# Altium schematic sheet czujniki.SchDoc
size A0; SheetNumber: 1; SheetTotal: 7
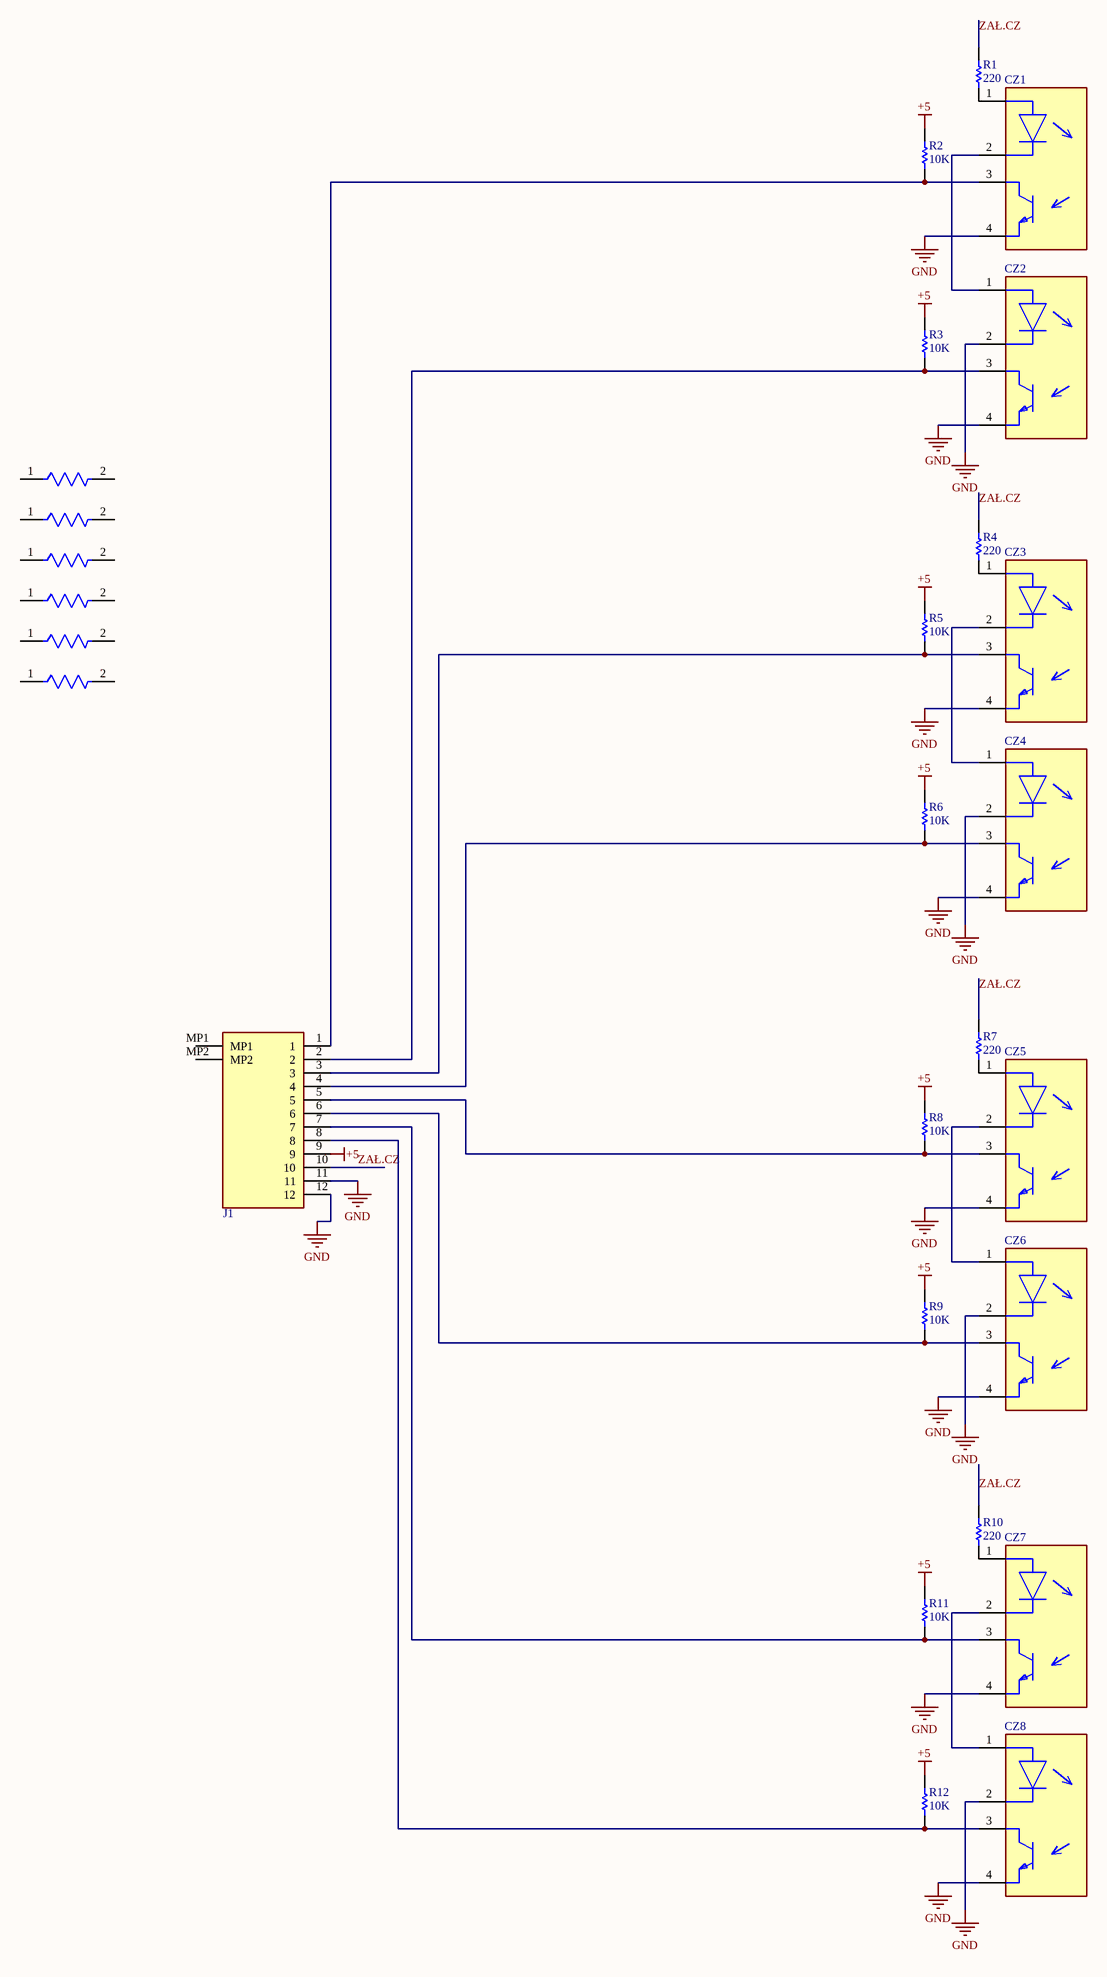
[diagram p0: czujniki.SchDoc]

## Parts
(Parts that share a designator on the sheet are numbered #1, #2 ... from top to bottom, then left to right.)
CZ1  QRE1113GR  [FP-100CY-MFG]  (value not drawn)
CZ2  QRE1113GR  [FP-100CY-MFG]  (value not drawn)
CZ3  QRE1113GR  [FP-100CY-MFG]  (value not drawn)
CZ4  QRE1113GR  [FP-100CY-MFG]  (value not drawn)
CZ5  QRE1113GR  [FP-100CY-MFG]  (value not drawn)
CZ6  QRE1113GR  [FP-100CY-MFG]  (value not drawn)
CZ7  QRE1113GR  [FP-100CY-MFG]  (value not drawn)
CZ8  QRE1113GR  [FP-100CY-MFG]  (value not drawn)
J1  AFA07-S12FCA-00  [AFA07S12FCA00]  (value not drawn)
R1  220  [RESC2013X70X40NL20T20]
R2  10K  [RESC2013X60X35NL10T20]
R3  10K  [RESC2013X60X35NL10T20]
R4  220  [RESC2013X70X40NL20T20]
R5  10K  [RESC2013X60X35NL10T20]
R6  10K  [RESC2013X60X35NL10T20]
R7  220  [RESC2013X70X40NL20T20]
R8  10K  [RESC2013X60X35NL10T20]
R9  10K  [RESC2013X60X35NL10T20]
R10  220  [RESC2013X70X40NL20T20]
R11  10K  [RESC2013X60X35NL10T20]
R12  10K  [RESC2013X60X35NL10T20]
R?#1  MRS25000C1002FCT00  [FP-MRS25-MFG]  (value not drawn)
R?#2  MRS25000C1002FCT00  [FP-MRS25-MFG]  (value not drawn)
R?#3  MRS25000C1002FCT00  [FP-MRS25-MFG]  (value not drawn)
R?#4  MRS25000C1002FCT00  [FP-MRS25-MFG]  (value not drawn)
R?#5  MRS25000C1002FCT00  [FP-MRS25-MFG]  (value not drawn)
R?#6  MRS25000C1002FCT00  [FP-MRS25-MFG]  (value not drawn)

## Nets
+5: J1.9 R2.2 R3.2 R5.2 R6.2 R8.2 R9.2 R11.2 R12.2
GND: CZ1.4(E) CZ2.2(C) CZ2.4(E) CZ3.4(E) CZ4.2(C) CZ4.4(E) CZ5.4(E) CZ6.2(C) CZ6.4(E) CZ7.4(E) CZ8.2(C) CZ8.4(E) J1.11 J1.12
ZAŁ.CZ: J1.10 R1.2 R4.2 R7.2 R10.2
NetCZ1_1: CZ1.1(A) R1.1
NetCZ1_2: CZ1.2(C) CZ2.1(A)
NetCZ1_3: CZ1.3(C) J1.1 R2.1
NetCZ2_3: CZ2.3(C) J1.2 R3.1
NetCZ3_1: CZ3.1(A) R4.1
NetCZ3_2: CZ3.2(C) CZ4.1(A)
NetCZ3_3: CZ3.3(C) J1.3 R5.1
NetCZ4_3: CZ4.3(C) J1.4 R6.1
NetCZ5_1: CZ5.1(A) R7.1
NetCZ5_2: CZ5.2(C) CZ6.1(A)
NetCZ5_3: CZ5.3(C) J1.5 R8.1
NetCZ6_3: CZ6.3(C) J1.6 R9.1
NetCZ7_1: CZ7.1(A) R10.1
NetCZ7_2: CZ7.2(C) CZ8.1(A)
NetCZ7_3: CZ7.3(C) J1.7 R11.1
NetCZ8_3: CZ8.3(C) J1.8 R12.1

Not connected (* = marked no-connect by the designer): J1 MP1 MP2; R?#1 1 2; R?#2 1 2; R?#3 1 2; R?#4 1 2; R?#5 1 2; R?#6 1 2

## Library data of the parts
CZ1-CZ8 = CMP-2000-06919-2: SENSOR OPTO TRANS REFL SMD PHOTO; Wavelength: 940nm; Fall Time: 20us; Forward Current: 50mA; Max Power Dissipation: 75mW; Operating Supply Voltage: 1.7V; Reverse Voltage (DC): 5V; Max Breakdown Voltage: 30V; Forward Voltage: 1.2V; Output Type: Phototransistor; Number of Elements: 1; Sensing Distance: 0.197inch; Max Collector Current: 20mA; Contact Plating: Tin; Packaging: Tape and Reel; Rise Time: 20us; Response Time: 20us; Case/Package: SMD/SMT; REACH SVHC: No SVHC; Lead Free: Lead Free; Width: 2.9mm; Package Quantity: 1000; Mount: Surface Mount; Input Current: 50mA; Max Operating Temperature: 85°C; Weight: 0.078g; Power Dissipation: 75mW; Reverse Breakdown Voltage: 5V; Collector Emitter Voltage (VCEO): 30V; Collector Emitter Breakdown Voltage: 30V; Number of Pins: 4; Min Operating Temperature: -40°C; Radiation Hardening: No; Height: 1.7mm; Number of Channels: 1; Length: 3.6mm
J1 = AFA07-S12FCA-00: FFC, FPC Connectors P=1mm RoHS; Manufacturer_Name: JUSHUO; Geometry.Height: 2.6mm; Manufacturer_Part_Number: AFA07-S12FCA-00; Mouser Part Number: *; Mouser Price/Stock: *; Arrow Part Number: *; Arrow Price/Stock: *; Datasheet Link: https://datasheet.lcsc.com/szlcsc/JUSHUO-AFA07-S12FCA-00_C262718.pdf
R1 R4 R7 R10 = CMP-2001-00044-1: Part Number: ERJ6ENF2200V; Manufacturer: Panasonic
R2 R3 R5 R6 R8 R9 R11 R12 = CMP-1659-00013-4: Chip Resistor, 10 KOhm, +/- 1%, 0.125 W, -55 to 155 degC, 0805 (2012 Metric), RoHS, Tape and Reel; Manufacturer: Yageo; Voltage Rating: 150 V; Mount: Surface Mount; ComponentLink1Description: Manufacturer URL; ComponentLink2URL: http://www.yageo.com/documents/recent/PYu-RC_Group_51_RoHS_L_04.pdf; Pins: 2; Length: 2 mm; Min Operating Temperature: -55 degC; Height: 0.5 mm; Mounting Technology: Surface Mount; RoHSCompliant: true; REACH SVHC: No SVHC; ComponentLink1URL: http://www.yageo.com/; Max Operating Temperature: 155 degC; PackageReference: 0805; DatasheetVersion: Rev. 4, 02/2016; Package Quantity: 5000; Packaging: Tape and Reel; ComponentLink2Description: Datasheet; PackageDescription: 2-Pin Surface Mounted Device, Body 2 x 1.25 mm
R?#1-R?#6 = CMP-00030-42632392-1: MRS25000C1002FCT00 Resistor, 10 kOhm, ± 1%, 600 mW, Axial Leaded, Metal Film (Thin Film), Professional; Power Rating: 600mW; Voltage Rating (DC): 350V; Lead Length: 26mm; Resistance: 10kΩ; Temperature Coefficient: 50ppm/°C; Termination: Axial; Number of Terminations: 2; Diameter: 2.5mm; Composition: Metal Film, Thin Film; Number of Pins: 2; Length: 6.5mm; Military Standard: Not; RoHS: Compliant; NexarPartId: 42632392; Width: 2.5mm; Radiation Hardening: No; Voltage Rating: 350V; Max Power Dissipation: 600mW; Min Operating Temperature: -55°C; Lead Free: Lead Free; Max Operating Temperature: 155°C; Tolerance: 1%; Schedule B: 8533210090, 8533210090; Contact Plating: Tin; Mount: Through Hole; REACH SVHC: Unknown; Case/Package: Conformal